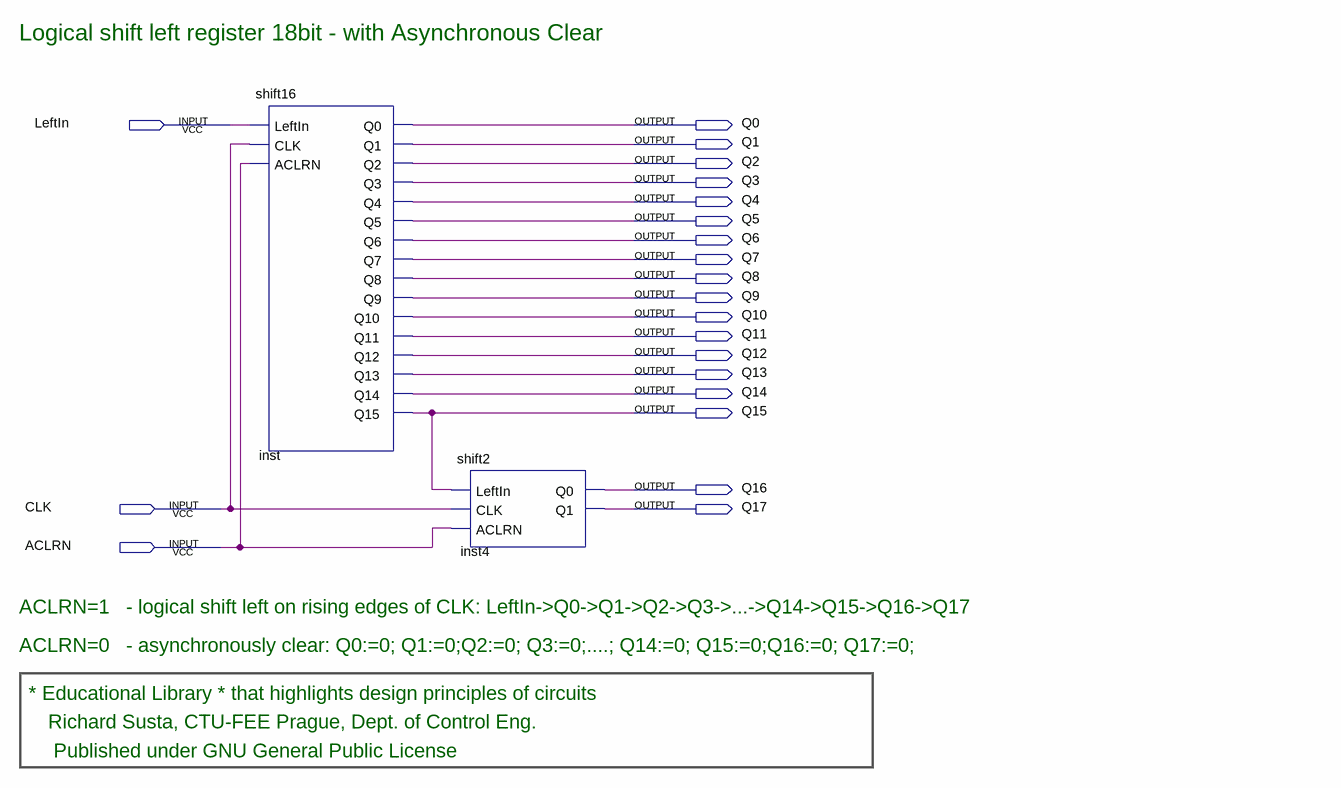
[diagram p0: schematic sheet]
// Quartus schematic shift18.bdf as structural Verilog: 2 symbols, 21 pins
module shift18 (
  input  LeftIn,
  input  CLK,
  input  ACLRN,
  output Q0,
  output Q1,
  output Q2,
  output Q3,
  output Q4,
  output Q5,
  output Q6,
  output Q7,
  output Q8,
  output Q9,
  output Q10,
  output Q11,
  output Q12,
  output Q13,
  output Q14,
  output Q15,
  output Q16,
  output Q17
);

  shift16 inst (
    .LeftIn(LeftIn), .CLK(CLK), .ACLRN(ACLRN), .Q0(Q0), .Q1(Q1), .Q2(Q2), .Q3(Q3), .Q4(Q4), .Q5(Q5), .Q6(Q6),
    .Q7(Q7), .Q8(Q8), .Q9(Q9), .Q10(Q10), .Q11(Q11), .Q12(Q12), .Q13(Q13), .Q14(Q14), .Q15(Q15));
  shift2 inst4 (.LeftIn(Q15), .CLK(CLK), .ACLRN(ACLRN), .Q0(Q16), .Q1(Q17));

  // Notes on the sheet:
  //   Logical shift left register 18bit - with Asynchronous Clear
  //   ACLRN=1   - logical shift left on rising edges of CLK: LeftIn->Q0->Q1->Q2->Q3->...->Q14->Q15->Q16->Q17
  //   ACLRN=0   - asynchronously clear: Q0:=0; Q1:=0;Q2:=0; Q3:=0;....; Q14:=0; Q15:=0;Q16:=0; Q17:=0;
  //   * Educational Library * that highlights design principles of circuits
  //   Richard Susta, CTU-FEE Prague, Dept. of Control Eng. 
  //    Published under GNU General Public License
endmodule
